# Altium schematic sheet CellCircuit.SchDoc
size A3; SheetNumber: 3; SheetTotal: 5
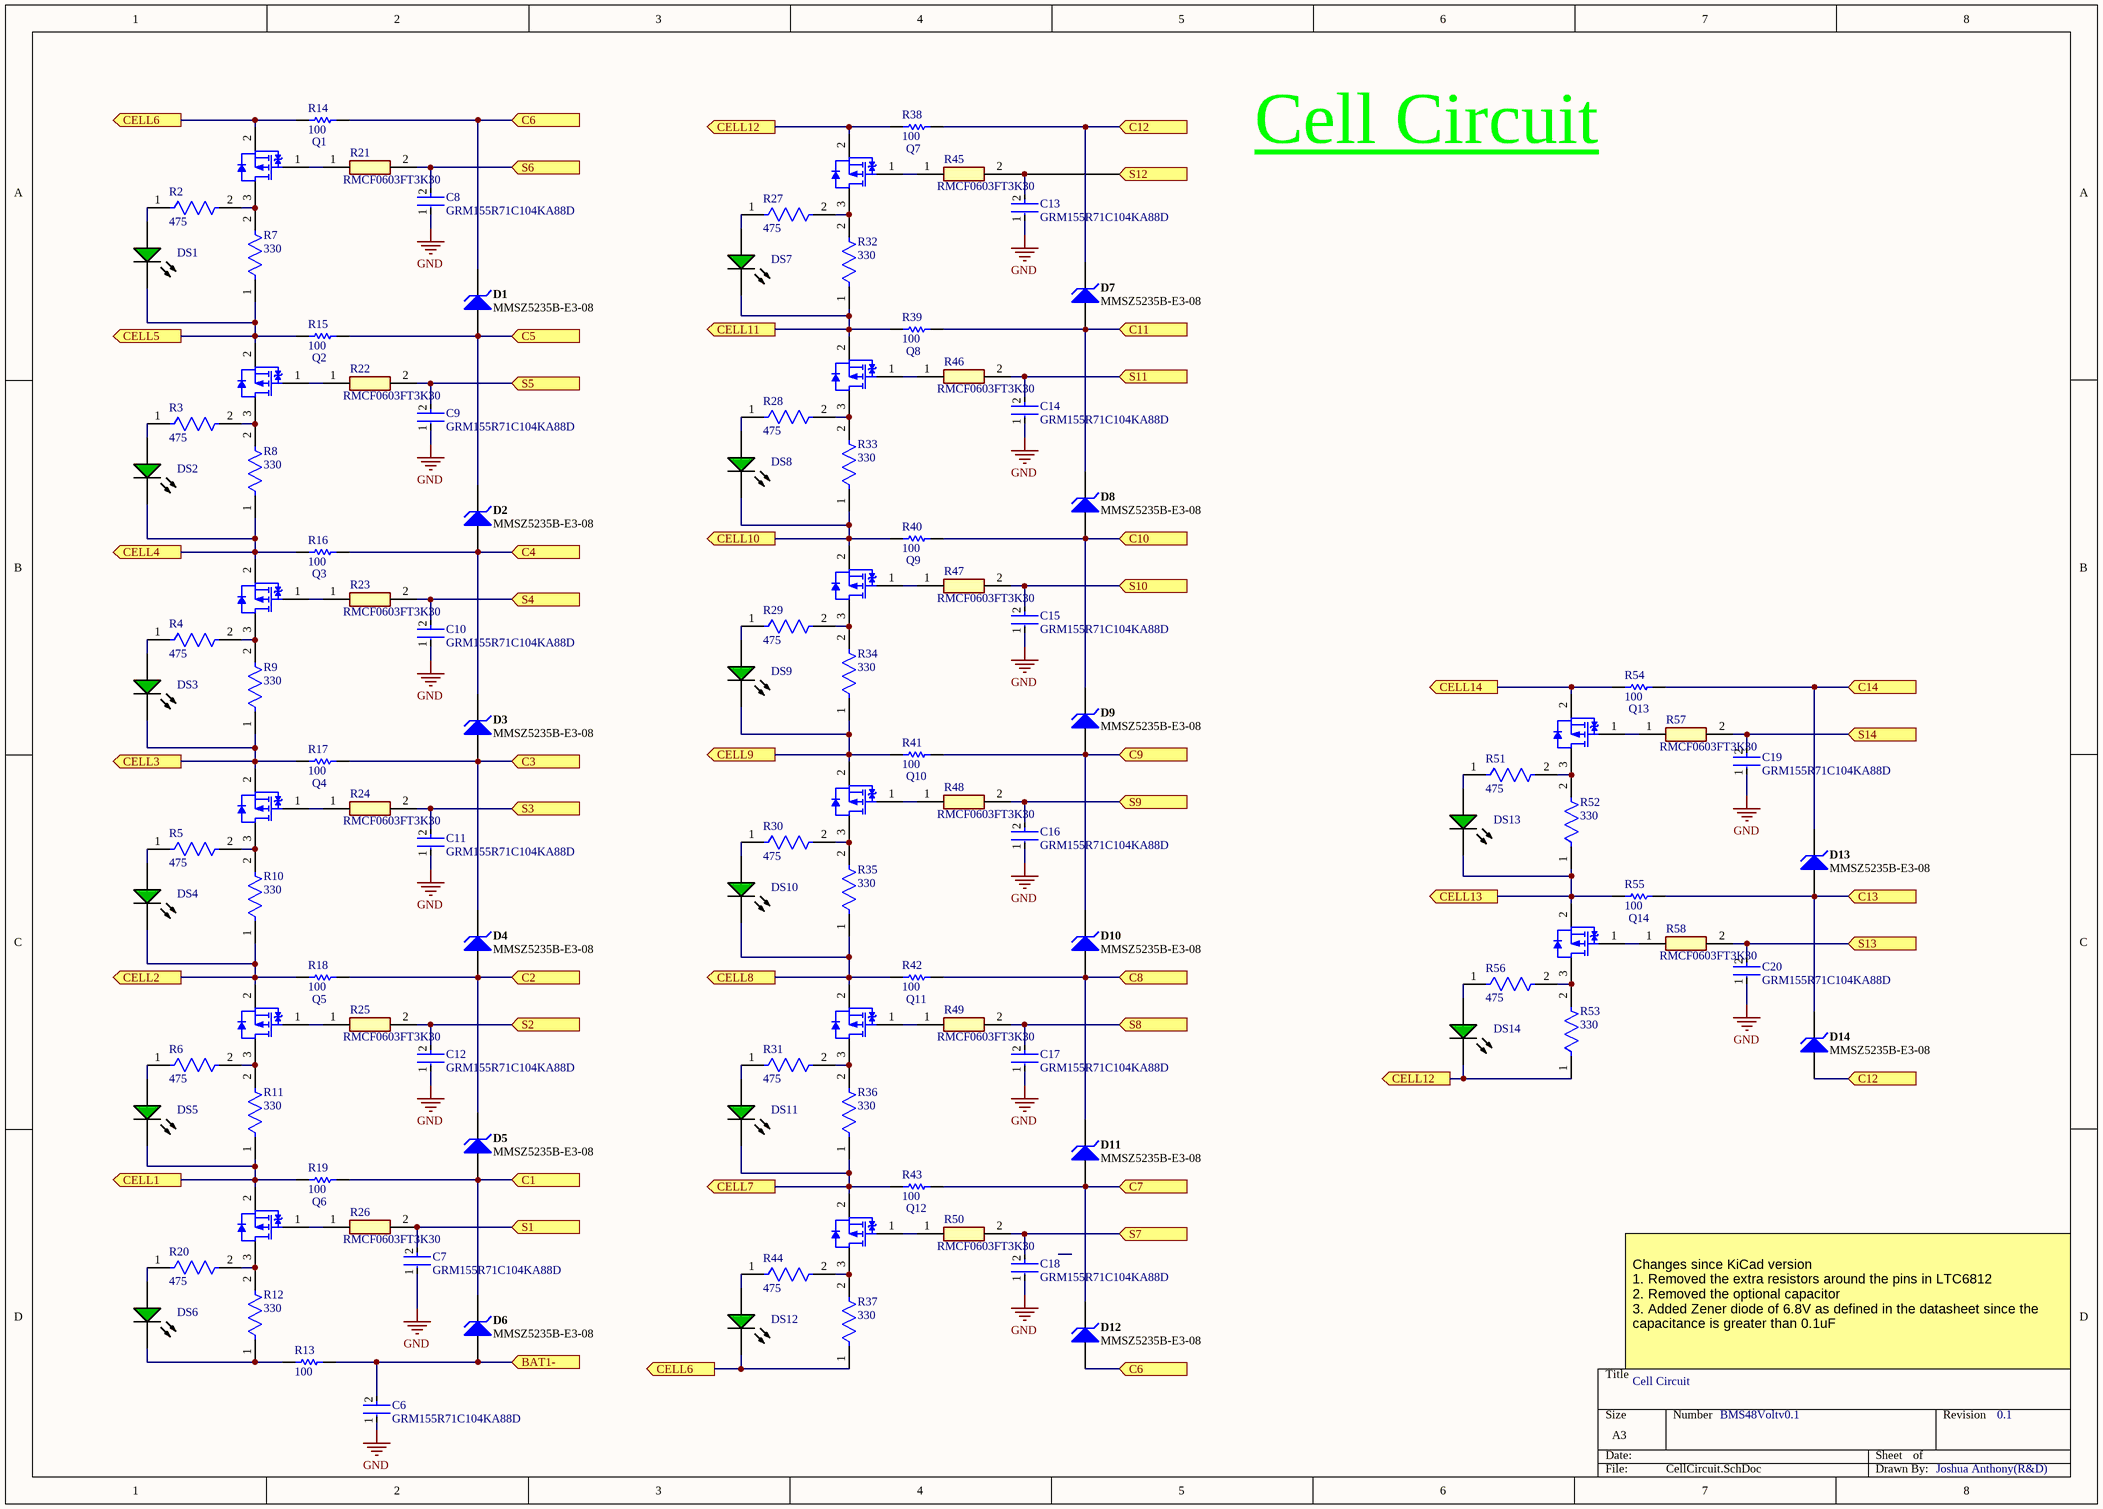
[diagram p0: CellCircuit.SchDoc]

## Parts
C6  GRM155R71C104KA88D  [FP-GRM15-MFG]
C7  GRM155R71C104KA88D  [FP-GRM15-MFG]
C8  GRM155R71C104KA88D  [FP-GRM15-MFG]
C9  GRM155R71C104KA88D  [FP-GRM15-MFG]
C10  GRM155R71C104KA88D  [FP-GRM15-MFG]
C11  GRM155R71C104KA88D  [FP-GRM15-MFG]
C12  GRM155R71C104KA88D  [FP-GRM15-MFG]
C13  GRM155R71C104KA88D  [FP-GRM15-MFG]
C14  GRM155R71C104KA88D  [FP-GRM15-MFG]
C15  GRM155R71C104KA88D  [FP-GRM15-MFG]
C16  GRM155R71C104KA88D  [FP-GRM15-MFG]
C17  GRM155R71C104KA88D  [FP-GRM15-MFG]
C18  GRM155R71C104KA88D  [FP-GRM15-MFG]
C19  GRM155R71C104KA88D  [FP-GRM15-MFG]
C20  GRM155R71C104KA88D  [FP-GRM15-MFG]
D1  MMSZ5235B-E3-08  [VISH-SOD-123-2_V]
D2  MMSZ5235B-E3-08  [VISH-SOD-123-2_V]
D3  MMSZ5235B-E3-08  [VISH-SOD-123-2_V]
D4  MMSZ5235B-E3-08  [VISH-SOD-123-2_V]
D5  MMSZ5235B-E3-08  [VISH-SOD-123-2_V]
D6  MMSZ5235B-E3-08  [VISH-SOD-123-2_V]
D7  MMSZ5235B-E3-08  [VISH-SOD-123-2_V]
D8  MMSZ5235B-E3-08  [VISH-SOD-123-2_V]
D9  MMSZ5235B-E3-08  [VISH-SOD-123-2_V]
D10  MMSZ5235B-E3-08  [VISH-SOD-123-2_V]
D11  MMSZ5235B-E3-08  [VISH-SOD-123-2_V]
D12  MMSZ5235B-E3-08  [VISH-SOD-123-2_V]
D13  MMSZ5235B-E3-08  [VISH-SOD-123-2_V]
D14  MMSZ5235B-E3-08  [VISH-SOD-123-2_V]
DS1  HSMG-C170  [AVAG-HSMX-C170_V]  (value not drawn)
DS2  HSMG-C170  [AVAG-HSMX-C170_V]  (value not drawn)
DS3  HSMG-C170  [AVAG-HSMX-C170_V]  (value not drawn)
DS4  HSMG-C170  [AVAG-HSMX-C170_V]  (value not drawn)
DS5  HSMG-C170  [AVAG-HSMX-C170_V]  (value not drawn)
DS6  HSMG-C170  [AVAG-HSMX-C170_V]  (value not drawn)
DS7  HSMG-C170  [AVAG-HSMX-C170_V]  (value not drawn)
DS8  HSMG-C170  [AVAG-HSMX-C170_V]  (value not drawn)
DS9  HSMG-C170  [AVAG-HSMX-C170_V]  (value not drawn)
DS10  HSMG-C170  [AVAG-HSMX-C170_V]  (value not drawn)
DS11  HSMG-C170  [AVAG-HSMX-C170_V]  (value not drawn)
DS12  HSMG-C170  [AVAG-HSMX-C170_V]  (value not drawn)
DS13  HSMG-C170  [AVAG-HSMX-C170_V]  (value not drawn)
DS14  HSMG-C170  [AVAG-HSMX-C170_V]  (value not drawn)
Q1  BSS308PE  [INF-PG-SOT23_L]  (value not drawn)
Q2  BSS308PE  [INF-PG-SOT23_L]  (value not drawn)
Q3  BSS308PE  [INF-PG-SOT23_L]  (value not drawn)
Q4  BSS308PE  [INF-PG-SOT23_L]  (value not drawn)
Q5  BSS308PE  [INF-PG-SOT23_L]  (value not drawn)
Q6  BSS308PE  [INF-PG-SOT23_L]  (value not drawn)
Q7  BSS308PE  [INF-PG-SOT23_L]  (value not drawn)
Q8  BSS308PE  [INF-PG-SOT23_L]  (value not drawn)
Q9  BSS308PE  [INF-PG-SOT23_L]  (value not drawn)
Q10  BSS308PE  [INF-PG-SOT23_L]  (value not drawn)
Q11  BSS308PE  [INF-PG-SOT23_L]  (value not drawn)
Q12  BSS308PE  [INF-PG-SOT23_L]  (value not drawn)
Q13  BSS308PE  [INF-PG-SOT23_L]  (value not drawn)
Q14  BSS308PE  [INF-PG-SOT23_L]  (value not drawn)
R2  475  [FP-CR0603-MFG]
R3  475  [FP-CR0603-MFG]
R4  475  [FP-CR0603-MFG]
R5  475  [FP-CR0603-MFG]
R6  475  [FP-CR0603-MFG]
R7  330  [FP-CRCW0603-e3-MFG]
R8  330  [FP-CRCW0603-e3-MFG]
R9  330  [FP-CRCW0603-e3-MFG]
R10  330  [FP-CRCW0603-e3-MFG]
R11  330  [FP-CRCW0603-e3-MFG]
R12  330  [FP-CRCW0603-e3-MFG]
R13  100  [RESC1005X40X25LL05T05]
R14  100  [RESC1005X40X25LL05T05]
R15  100  [RESC1005X40X25LL05T05]
R16  100  [RESC1005X40X25LL05T05]
R17  100  [RESC1005X40X25LL05T05]
R18  100  [RESC1005X40X25LL05T05]
R19  100  [RESC1005X40X25LL05T05]
R20  475  [FP-CR0603-MFG]
R21  RMCF0603FT3K30  [RESC1608X55N]
R22  RMCF0603FT3K30  [RESC1608X55N]
R23  RMCF0603FT3K30  [RESC1608X55N]
R24  RMCF0603FT3K30  [RESC1608X55N]
R25  RMCF0603FT3K30  [RESC1608X55N]
R26  RMCF0603FT3K30  [RESC1608X55N]
R27  475  [FP-CR0603-MFG]
R28  475  [FP-CR0603-MFG]
R29  475  [FP-CR0603-MFG]
R30  475  [FP-CR0603-MFG]
R31  475  [FP-CR0603-MFG]
R32  330  [FP-CRCW0603-e3-MFG]
R33  330  [FP-CRCW0603-e3-MFG]
R34  330  [FP-CRCW0603-e3-MFG]
R35  330  [FP-CRCW0603-e3-MFG]
R36  330  [FP-CRCW0603-e3-MFG]
R37  330  [FP-CRCW0603-e3-MFG]
R38  100  [RESC1005X40X25LL05T05]
R39  100  [RESC1005X40X25LL05T05]
R40  100  [RESC1005X40X25LL05T05]
R41  100  [RESC1005X40X25LL05T05]
R42  100  [RESC1005X40X25LL05T05]
R43  100  [RESC1005X40X25LL05T05]
R44  475  [FP-CR0603-MFG]
R45  RMCF0603FT3K30  [RESC1608X55N]
R46  RMCF0603FT3K30  [RESC1608X55N]
R47  RMCF0603FT3K30  [RESC1608X55N]
R48  RMCF0603FT3K30  [RESC1608X55N]
R49  RMCF0603FT3K30  [RESC1608X55N]
R50  RMCF0603FT3K30  [RESC1608X55N]
R51  475  [FP-CR0603-MFG]
R52  330  [FP-CRCW0603-e3-MFG]
R53  330  [FP-CRCW0603-e3-MFG]
R54  100  [RESC1005X40X25LL05T05]
R55  100  [RESC1005X40X25LL05T05]
R56  475  [FP-CR0603-MFG]
R57  RMCF0603FT3K30  [RESC1608X55N]
R58  RMCF0603FT3K30  [RESC1608X55N]

## Ports
BAT1- (in), C1 (in), C2 (in), C3 (in), C4 (in), C5 (in), C6 (in), C7 (in), C8 (in), C9 (in), C10 (in), C11 (in), C12 (in), C13 (in), C14 (in), CELL1 (out), CELL2 (out), CELL3 (out), CELL4 (out), CELL5 (out), CELL6 (out), CELL7 (out), CELL8 (out), CELL9 (out), CELL10 (out), CELL11 (out), CELL12 (out), CELL13 (out), CELL14 (out), S1 (in), S2 (in), S3 (in), S4 (in), S5 (in), S6 (in), S7 (in), S8 (in), S9 (in), S10 (in), S11 (in), S12 (in), S13 (in), S14 (in)

## Nets
GND: C6.1 C7.1 C8.1 C9.1 C10.1 C11.1 C12.1 C13.1 C14.1 C15.1 C16.1 C17.1 C18.1 C19.1 C20.1
BAT1-: C6.2 D6.1(A) R13.2 ; port BAT1-
C1: D5.1(A) D6.2(K) R19.2 ; port C1
C2: D4.1(A) D5.2(K) R18.2 ; port C2
C3: D3.1(A) D4.2(K) R17.2 ; port C3
C4: D2.1(A) D3.2(K) R16.2 ; port C4
C5: D1.1(A) D2.2(K) R15.2 ; port C5
C6: D1.2(K) D12.1(A) R14.2 ; port C6
C7: D11.1(A) D12.2(K) R43.2 ; port C7
C8: D10.1(A) D11.2(K) R42.2 ; port C8
C9: D9.1(A) D10.2(K) R41.2 ; port C9
C10: D8.1(A) D9.2(K) R40.2 ; port C10
C11: D7.1(A) D8.2(K) R39.2 ; port C11
C12: D7.2(K) D14.1(A) R38.2 ; port C12
C13: D13.1(A) D14.2(K) R55.2 ; port C13
C14: D13.2(K) R54.2 ; port C14
CELL1: DS5.2(K) Q6.2(SOURCE) R11.1 R19.1 ; port CELL1
CELL2: DS4.2(K) Q5.2(SOURCE) R10.1 R18.1 ; port CELL2
CELL3: DS3.2(K) Q4.2(SOURCE) R9.1 R17.1 ; port CELL3
CELL4: DS2.2(K) Q3.2(SOURCE) R8.1 R16.1 ; port CELL4
CELL5: DS1.2(K) Q2.2(SOURCE) R7.1 R15.1 ; port CELL5
CELL6: DS12.2(K) Q1.2(SOURCE) R14.1 R37.1 ; port CELL6
CELL7: DS11.2(K) Q12.2(SOURCE) R36.1 R43.1 ; port CELL7
CELL8: DS10.2(K) Q11.2(SOURCE) R35.1 R42.1 ; port CELL8
CELL9: DS9.2(K) Q10.2(SOURCE) R34.1 R41.1 ; port CELL9
CELL10: DS8.2(K) Q9.2(SOURCE) R33.1 R40.1 ; port CELL10
CELL11: DS7.2(K) Q8.2(SOURCE) R32.1 R39.1 ; port CELL11
CELL12: DS14.2(K) Q7.2(SOURCE) R38.1 R53.1 ; port CELL12
CELL13: DS13.2(K) Q14.2(SOURCE) R52.1 R55.1 ; port CELL13
CELL14: Q13.2(SOURCE) R54.1 ; port CELL14
S1: C7.2 R26.2 ; port S1
S2: C12.2 R25.2 ; port S2
S3: C11.2 R24.2 ; port S3
S4: C10.2 R23.2 ; port S4
S5: C9.2 R22.2 ; port S5
S6: C8.2 R21.2 ; port S6
S7: C18.2 R50.2 ; port S7
S8: C17.2 R49.2 ; port S8
S9: C16.2 R48.2 ; port S9
S10: C15.2 R47.2 ; port S10
S11: C14.2 R46.2 ; port S11
S12: C13.2 R45.2 ; port S12
S13: C20.2 R58.2 ; port S13
S14: C19.2 R57.2 ; port S14
NetDS1_1: DS1.1(A) R2.1
NetDS2_1: DS2.1(A) R3.1
NetDS3_1: DS3.1(A) R4.1
NetDS4_1: DS4.1(A) R5.1
NetDS5_1: DS5.1(A) R6.1
NetDS6_1: DS6.1(A) R20.1
NetDS6_2: DS6.2(K) R12.1 R13.1
NetDS7_1: DS7.1(A) R27.1
NetDS8_1: DS8.1(A) R28.1
NetDS9_1: DS9.1(A) R29.1
NetDS10_1: DS10.1(A) R30.1
NetDS11_1: DS11.1(A) R31.1
NetDS12_1: DS12.1(A) R44.1
NetDS13_1: DS13.1(A) R51.1
NetDS14_1: DS14.1(A) R56.1
NetQ1_1: Q1.1(GATE) R21.1
NetQ1_3: Q1.3(DRAIN) R2.2 R7.2
NetQ2_1: Q2.1(GATE) R22.1
NetQ2_3: Q2.3(DRAIN) R3.2 R8.2
NetQ3_1: Q3.1(GATE) R23.1
NetQ3_3: Q3.3(DRAIN) R4.2 R9.2
NetQ4_1: Q4.1(GATE) R24.1
NetQ4_3: Q4.3(DRAIN) R5.2 R10.2
NetQ5_1: Q5.1(GATE) R25.1
NetQ5_3: Q5.3(DRAIN) R6.2 R11.2
NetQ6_1: Q6.1(GATE) R26.1
NetQ6_3: Q6.3(DRAIN) R12.2 R20.2
NetQ7_1: Q7.1(GATE) R45.1
NetQ7_3: Q7.3(DRAIN) R27.2 R32.2
NetQ8_1: Q8.1(GATE) R46.1
NetQ8_3: Q8.3(DRAIN) R28.2 R33.2
NetQ9_1: Q9.1(GATE) R47.1
NetQ9_3: Q9.3(DRAIN) R29.2 R34.2
NetQ10_1: Q10.1(GATE) R48.1
NetQ10_3: Q10.3(DRAIN) R30.2 R35.2
NetQ11_1: Q11.1(GATE) R49.1
NetQ11_3: Q11.3(DRAIN) R31.2 R36.2
NetQ12_1: Q12.1(GATE) R50.1
NetQ12_3: Q12.3(DRAIN) R37.2 R44.2
NetQ13_1: Q13.1(GATE) R57.1
NetQ13_3: Q13.3(DRAIN) R51.2 R52.2
NetQ14_1: Q14.1(GATE) R58.1
NetQ14_3: Q14.3(DRAIN) R53.2 R56.2

## Notes on the sheet
- Cell Circuit
- Changes since KiCad version
  1. Removed the extra resistors around the pins in LTC6812
  2. Removed the optional capacitor
  3. Added Zener diode of 6.8V as defined in the datasheet since the capacitance is greater than 0.1uF
- BMS48Voltv0.1
- 0.1
- Joshua Anthony(R&D)

## Library data of the parts
C6-C20 = CMP-2100-03641-2: CAP CER 0.1UF 16V X7R 0402; Manufacturer: Murata; Standoff Height: 0mm; Tolerance: 10%; Voltage Rating: 16Vdc; Material: Ceramic; Capacitance: 0.10μF; Value: 0.10μF; RoHS: TRUE; Manufacturer Part Number: GRM155R71C104KA88D; Temperature Characteristic: X7R; Octopart: https://octopart.com/grm155r71c104ka88d-murata-196880; Digikey Description: CAP CER 0.1UF 16V X7R 0402; Device Class L3: Ceramic Capacitors; Height: 0.55mm; ComponentLink2Description: Datasheet; Temperature Range Low: -55°C; Ipc Land Pattern Name: CAPC10050X219; ComponentLink2URL: https://search.murata.co.jp/Ceramy/image/img/A01X/G101/ENG/GRM155R71H471KA01-01A.pdf; Device Class L1: Passive Components; Lead Free: yes; Category: Cap; Package: GRM15; Temperature: -55°C to +125°C; Device Class L2: Capacitors; Temperature Range High: +125°C; Mouser Description: 0402 0.1 uF 16V ±10 % Tolerance X7R SMT Multilayer Ceramic Capacitor
D1-D14 = CMP-0931-00023-1: Small Signal Zener Diode, 6.8 V +/- 5%, -55 to 155 degC, 2-Pin SOD-123, RoHS, Tape and Reel; Manufacturer: Vishay Semiconductor; Zener Impedance (IZT1) (Max.) (Ohm): 5; Test Current (IZT1) (mA): 20; Power Dissipation (mW): 500; Tolerance: +/- 5%; Int. Construction: Single; Zener Voltage (NOM.) (V): 6.8; Mounting Technology: Surface Mount; DatasheetVersion: Rev. 1.9; ComponentLink3Description: Package Specification; ComponentLink3URL: http://www.vishay.com/docs/85774/mmsz5225.pdf; ComponentLink2URL: http://www.vishay.com/docs/85774/mmsz5225.pdf; RoHS: TRUE; Packing: Tape and Reel; ComponentLink2Description: Datasheet; PackageVersion: Rev. 1.9; PackageReference: SOD-123-2; PackageDescription: 2-Pin SMD, Body 2.7 x 1.55 mm, Height 1.35 mm; PartNumber: MMSZ5235B-E3-08; Operating Temperature: -55 to 150 degC; ComponentLink1Description: Manufacturer URL; ComponentLink1URL: http://www.vishay.com/
DS1-DS14 = CMP-2000-05062-1: Chip LED, Green, 2.2 V, -40 to 85 degC, 2-Pin SMD, Pb-Free, Tape and Reel; Manufacturer: Avago; No. of Pins: 2; Peak Wavelength: 570nm; SVHC: NoSVHC(16-Jun-2014); Dominant Wavelength: 572nm; Forward Current If: 20mA; Viewing Angle: 170deg; Lens Shape: Rectangular; PIV Max: 5V; External Width: 1.25mm; LED Type: Standard; External Depth: 0.8mm; Opto Mounting Orientation: Top; Luminous Intensity: 15mcd; Luminous Intensity Min: 4mcd; Forward Voltage VF Max: 2.6V; External Length / Height: 2mm; Bulb Size: 1.25mmx1.4mm; Light Area Height: 1mm; Voltage Vf Typ: 2.2V; Operating Temperature Max: 85degC; Datasheet Version: Oct-08; MSL: MSL2A-4weeks; Peak Forward Current: 20mA; Package Description: 2-Pin Surface Mount Device, Body 2 x 1.25 mm, Height 0.8 mm; Datasheet URL: https://datasheet.ciiva.com/29280/180495-da-01-en-chip-led-hsmg-c170-gelb-gruen-29280971.pdf; Storage Temperature Min: -40degC; LED Colour: Green; Wavelength Typ: 570nm; Mounting Type: SMD; Forward Current If Max: 20mA; Dominant Wavelength Typ: 572nm; LED Mounting: SMD; Operating Temperature Range: -30degCto+85degC; Operating Temperature Min: -30degC; Manufacturer URL: http://www.avagotech.com/; Packaging: CutTape; Luminous Intensity Typ: 15mcd; Package Reference: HSMX-C170; Storage Temperature Max: 85degC; Opto Case Style: SMD; Forward Voltage: 2.2V
Q1-Q14 = CMP-1099-00030-1: P-Channel OptiMOS P3 Small-Signal-Transistor, -30 V VDS, -2 A ID, -55 to 150 degC, PG-SOT23, Reel, Green; Manufacturer: Infineon; RDS (on) (max) (@4.5V): 130Â mOhm; Pto t (max): 0.5Â W; ID (max): -2Â A; IDpuls (max): -8Â A; VDS (max): -30Â V; VGS(th) (min): -2Â V; Green: TRUE; RDS (on) (max): 80Â mOhm; QG: -5Â nC; Rth: 250Â K/W; VGS(th) (max): -1Â V; PartNumber: BSS308PE; ComponentLink3Description: Package Specification; PackageDescription: 3-Pin Small Outline Transistor Package, 2.9 x 1.3 mm Body, 0.95 mm Pitch; Mounting Technology: Surface Mount; Packing: Reel; PackageReference: PG-SOT23; PackageVersion: Apr-08; Halogen-free: TRUE; DatasheetVersion: Rev. 2.03; ComponentLink2URL: http://www.infineon.com/dgdl/BSS308PE_Rev23_.pdf?folderId=db3a304314dca38901154a72e3951a65&fileId=db3a304330f686060131099c80400073; ComponentLink2Description: Datasheet; ComponentLink1Description: Manufacturer URL; ComponentLink1URL: http://www.infineon.com/; ComponentLink3URL: http://www.infineon.com/dgdl/SOT23-Package_Overview.pdf?folderId=db3a30431936bc4b0119532290053c66&fileId=db3a30431936bc4b0119533468123c85
R2-R6 R20 R27-R31 R44 R51 R56 = CMP-07231-006138-1: Thick Film Chip Resistors 0603 475Ω 0.1W 1% 100ppm/°C; Voltage Rating: 50V; Power Rating: 100mW; Resistance: 475R; Width: 0.031inch; Features: Moisture Resistant; Termination: SMD/SMT; Case Code (Metric): 1608; Contact Plating: Tin; Length: 1.6mm; Thickness: 457um; Temperature Coefficient: 100ppm/°C; Radiation Hardening: No; Max Operating Temperature: 155°C; Resistor Type: Thick Film; Number of Terminations: 2; Min Operating Temperature: -55°C; Case Code (Imperial): 0603; Package Quantity: 1; Military Standard: Not; Series: CR0603; Packaging: Tape and Reel; Tolerance: 1%; Case/Package: 0603; Depth: 0.8mm; Mount: Surface Mount; Max Power Dissipation: 100mW; Height: 0.022inch; Construction: Rectangular
R7-R12 R32-R37 R52 R53 = CMP-1012-00454-3: RES Thick Film, 330Ω, 1%, 0.1W, 100ppm/°C, 0603; Voltage Rating: 75V; Max Power Dissipation: 100mW; Resistance: 330R; Depth: 0.85mm; Contact Plating: Tin; Package Quantity: 10; Termination: SMD/SMT; Tolerance: 1%; Height: 0.45mm; Number of Terminations: 2; Radiation Hardening: No; Features: Automotive AEC-Q200; Case/Package: 0603; Mount: Surface Mount; Case Code (Metric): 1608; Lead Free: Lead Free; Temperature Coefficient: 100ppm/°C; Weight: 7.1E-05oz; Military Standard: Not; Packaging: Tape and Reel; Max Operating Temperature: 155°C; Voltage Rating (DC): 75V; Length: 1.55mm; Min Operating Temperature: -55°C; Composition: Thick Film; Case Code (Imperial): 0603; Width: 0.033inch; Power Rating: 100mW
R13-R19 R38-R43 R54 R55 = CMP-2002-00605-3: Chip Resistor, 100 Ohm, +/- 1%, 100 mW, -55 to 155 degC, 0402 (1005 Metric), RoHS, Tape and Reel; Manufacturer: Basic Passives; PartNumber: ERJ-2RKF1000X; Power Rating: 100 mW; Resistance: 100 Ohm; Voltage Rating: 50 V; Case\/Package: 0402; Width: 0.5 mm; Pins: 2; ComponentLink2Description: Datasheet; PackageReference: 0402; Height: 0.35 mm; Tolerance: 1%; DatasheetVersion: 04/2015; Case Code (Imperial): 0402; Min Operating Temperature: -55 degC; Radiation Hardening: No; Length: 1 mm; Package Quantity: 10000; PackageDescription: 2-Pin Surface Mount Device, Body 1 x 0.5 mm; Mounting Technology: Surface Mount; Case Code (Metric): 1005; Packaging: Tape and Reel; ComponentLink1URL: http://www.panasonic.com/; RoHSCompliant: true; Max Operating Temperature: 155 degC; REACH SVHC: Yes; ComponentLink1Description: Manufacturer URL; ComponentLink2URL: http://industrial.panasonic.com/cdbs/www-data/pdf/RDA0000/AOA0000C86.pdf; Mount: Surface Mount
R21-R26 R45-R50 R57 R58 = RMCF0603FT3K30: Resistor; Manufacturer_Name: Stackpole Electronics; Datasheet Link: https://www.seielect.com/Catalog/SEI-RMCF_RMCP.pdf; Height: 0.55mm; Manufacturer_Part_Number: RMCF0603FT3K30